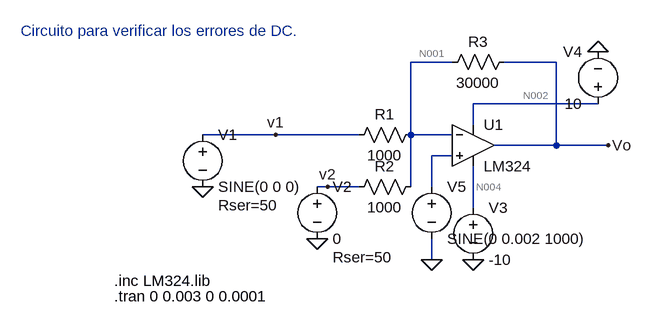
[diagram p0: schematic circuito1.2.asc]
circuito1.2.asc, the LTspice schematic file:
Version 4
SHEET 1 880 680
WIRE 160 16 96 16
WIRE 320 16 240 16
WIRE 384 80 192 80
WIRE 192 112 192 80
WIRE -112 128 -224 128
WIRE 16 128 -112 128
WIRE 96 128 96 16
WIRE 160 128 96 128
WIRE 320 144 320 16
WIRE 320 144 224 144
WIRE 400 144 320 144
WIRE 160 160 128 160
WIRE -32 208 -48 208
WIRE 16 208 -32 208
WIRE 96 208 96 128
WIRE 128 208 128 160
WIRE 192 240 192 176
WIRE 128 320 128 288
FLAG -224 208 0
FLAG -48 288 0
FLAG 192 320 0
FLAG 384 0 0
FLAG 400 144 Vo
FLAG -112 128 v1
FLAG -32 208 v2
FLAG 128 320 0
SYMBOL OpAmps\\opamp2 192 80 R0
SYMATTR InstName U1
SYMATTR Value LM324
SYMBOL res 112 112 R90
WINDOW 0 0 56 VBottom 2
WINDOW 3 32 56 VTop 2
SYMATTR InstName R1
SYMATTR Value 1000
SYMBOL res 112 192 R90
WINDOW 0 0 56 VBottom 2
WINDOW 3 32 56 VTop 2
SYMATTR InstName R2
SYMATTR Value 1000
SYMBOL res 256 0 R90
WINDOW 0 0 56 VBottom 2
WINDOW 3 32 56 VTop 2
SYMATTR InstName R3
SYMATTR Value 30000
SYMBOL voltage -224 112 R0
WINDOW 123 0 0 Left 0
WINDOW 39 24 124 Left 2
SYMATTR SpiceLine Rser=50
SYMATTR InstName V1
SYMATTR Value SINE(0 0 0)
SYMBOL voltage -48 192 R0
WINDOW 123 0 0 Left 0
WINDOW 39 24 124 Left 2
SYMATTR SpiceLine Rser=50
SYMATTR InstName V2
SYMATTR Value 0
SYMBOL voltage 192 224 R0
WINDOW 123 0 0 Left 0
WINDOW 39 0 0 Left 0
SYMATTR InstName V3
SYMATTR Value -10
SYMBOL voltage 384 96 R180
WINDOW 0 24 96 Left 2
WINDOW 3 24 16 Left 2
WINDOW 123 0 0 Left 0
WINDOW 39 0 0 Left 0
SYMATTR InstName V4
SYMATTR Value 10
SYMBOL voltage 128 192 R0
WINDOW 123 0 0 Left 0
WINDOW 39 0 0 Left 0
SYMATTR InstName V5
SYMATTR Value SINE(0 0.002 1000)
TEXT -360 352 Left 2 !.inc LM324.lib
TEXT -360 376 Left 2 !.tran 0 0.003 0 0.0001
TEXT -504 -32 Left 2 ;Circuito para verificar los errores de DC.

The netlist it stands for:
* circuito1.2.asc
XU1 N003 N001 N002 N004 Vo LM324  ; pins In+ In- V+ V- OUT
R1 N001 v1 1000
R2 N001 v2 1000
R3 Vo N001 30000
V1 v1 0 SINE(0 0 0) Rser=50
V2 v2 0 0 Rser=50
V3 N004 0 -10
V4 N002 0 10
V5 N003 0 SINE(0 0.002 1000)
.inc LM324.lib
.tran 0 0.003 0 0.0001
* Circuito para verificar los errores de DC.
.backanno
.end

* Results of the author's LTspice run, read from the files saved beside the schematic
* Operating Point, zero values left out:
*   V(vo) = -2.554 mV
*   V(n004) = -10 V
*   V(n002) = 10 V
*   V(n001) = -33.63 µV
*   V(v1) = -1.601 µV
*   V(v2) = -1.601 µV
*   I(R3) = -84 nA
*   I(R2) = -32.03 nA
*   I(R1) = -32.03 nA
*   I(V5) = 19.92 nA
*   I(V4) = -669.9 µA
*   I(V3) = 669.8 µA
*   I(V2) = -32.03 nA
*   I(V1) = -32.03 nA
*   Ix(u1:1) = -19.92 nA
*   Ix(u1:2) = -19.94 nA
*   Ix(u1:3) = 669.9 µA
*   Ix(u1:4) = -669.8 µA
*   Ix(u1:5) = 84 nA
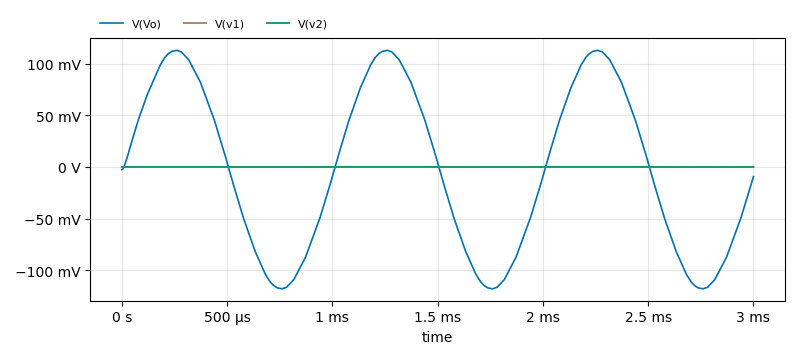
[diagram p1: Transient Analysis of circuito1.2.asc, plotted from the saved traces]
* Transient Analysis, 1 run:
*   V(Vo): min -118 mV, max 112.9 mV, average -2.499 mV, rms 80.97 mV, last -9.328 mV
*   V(v1): min -96.62 µV, max 93.41 µV, average -1.58 µV, rms 67.38 µV, last -7.149 µV
*   V(v2): min -96.62 µV, max 93.41 µV, average -1.58 µV, rms 67.38 µV, last -7.149 µV